# Altium project Cell430.PrjPcb (part 3 of 3)

## Sheet LTE_MCU_Rev01.SchDoc
size Letter; SheetNumber: 6; SheetTotal: 6
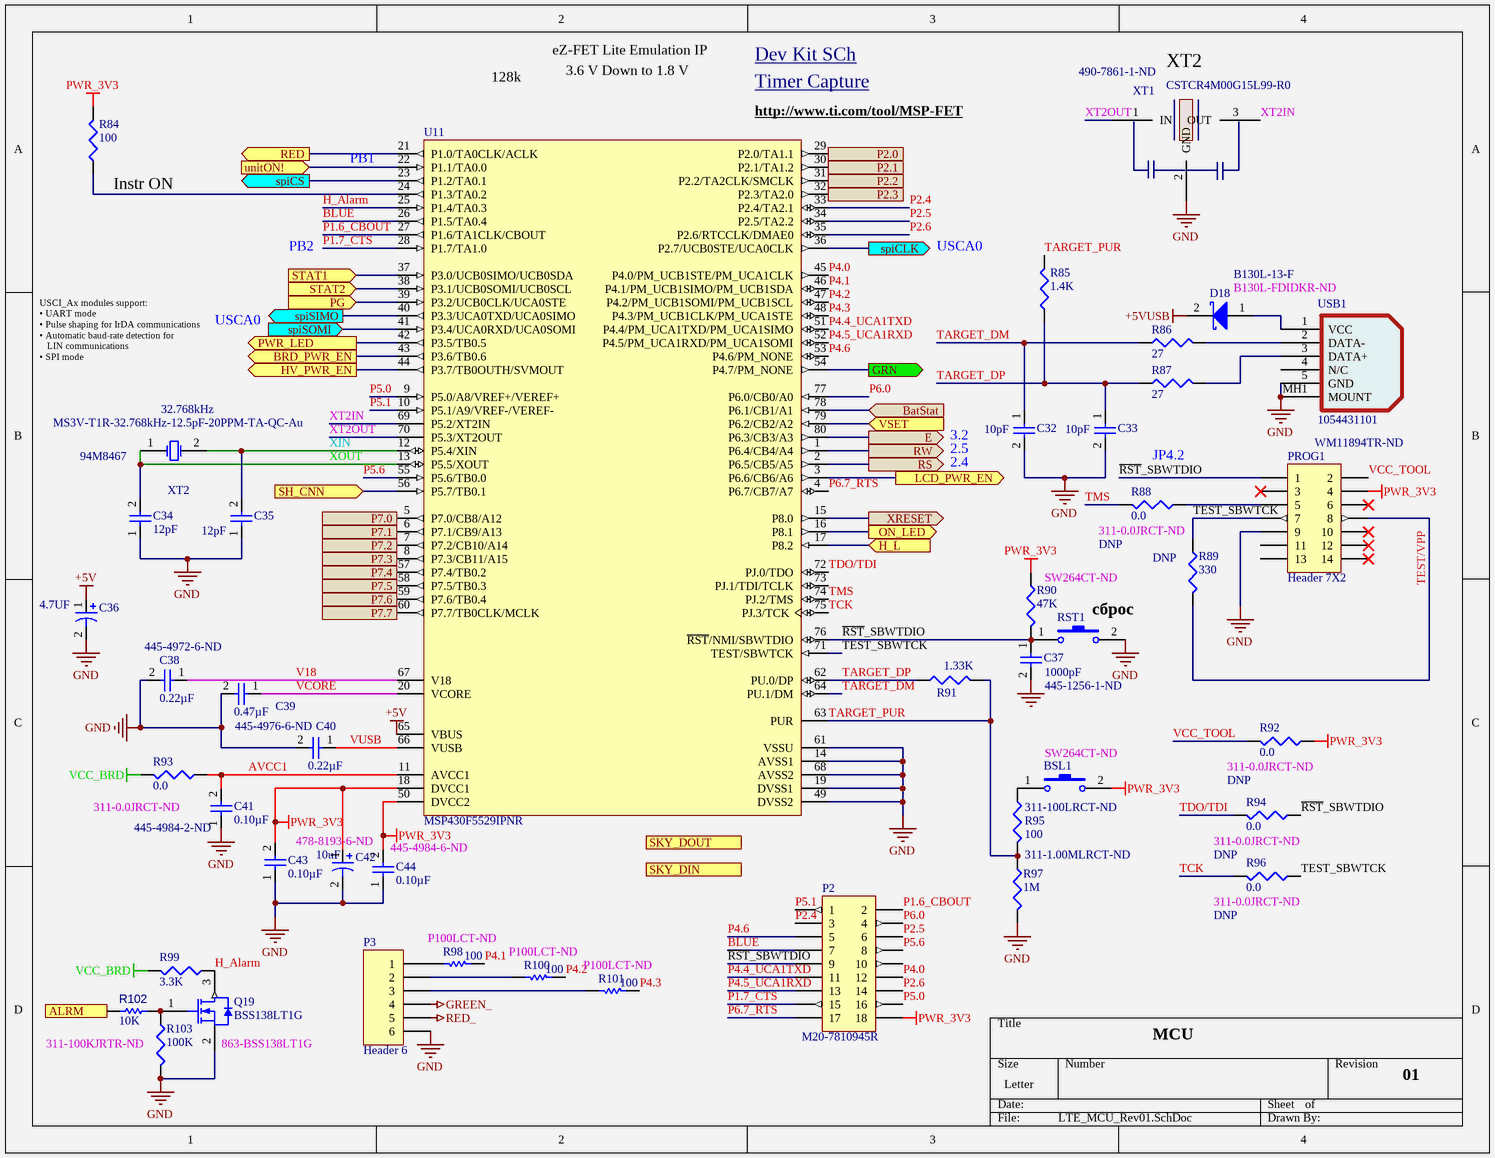
[diagram p5: LTE_MCU_Rev01.SchDoc]

### Parts
(Parts that share a designator on the sheet are numbered #1, #2 ... from top to bottom, then left to right.)
BSL1  Supplier Part Number 1: SW264CT-ND  [DTST-61K-Q_Rev01]  (hidden comment: B3F-6022)
C32  value 10pF  [SMD CAP 1005]  (hidden comment: C1005C0G1H100D050BA)
C33  value 10pF  [SMD CAP 1005]  (hidden comment: C1005C0G1H100D050BA)
C34  value 12pF  [SMD CAP 1005]  (hidden comment: C1005C0G1H120J050BA)
C35  value 12pF  [SMD CAP 1005]  (hidden comment: C1005C0G1H120J050BA)
C36  value 4.7UF  [TC3216-1206]  (hidden comment: T491A475K010AT)
C37  value 1000pF  Supplier Part Number 2: 445-1256-1-ND  [SMD CAP 1005]  (hidden comment: C1005X7R1H102K050BA)
C38  value 0.22µF  Supplier Part Number 2: 445-4972-6-ND  [SMD CAP 1005]  (hidden comment: C1005X5R1C224K050BB)
C39  value 0.47µF  Supplier Part Number 2: 445-4976-6-ND  [SMD CAP 1005]  (hidden comment: C1005X5R1C474K050BC)
C40  value 0.22µF  [SMD CAP 1005]  (hidden comment: C1005X5R1C224K050BB)
C41  value 0.10µF  Supplier Part Number 2: 445-4984-2-ND  [SMD CAP 1005]  (hidden comment: C1005X5R1A104M050BA)
C42  value 10uF  Supplier Part Number 2: 478-8193-6-ND  [TC3216-1206]  (hidden comment: F931A106MAA)
C43  value 0.10µF  [SMD CAP 1005]  (hidden comment: C1005X5R1A104M050BA)
C44  value 0.10µF  Supplier Part Number 2: 445-4984-6-ND  [SMD CAP 1005]  (hidden comment: C1005X5R1A104M050BA)
D18  B130L-13-F  Supplier Part Number 1: B130L-FDIDKR-ND  [SMA]
P2#2  M20-7810945R  [M20-7810945R]
P3  Header 6  [HDR1X6]
PROG1  Header 7X2  [HDR2X7]
Q19  BSS138LT1G  Supplier Part Number 1: 863-BSS138LT1G  [ONSC-SOT-23-3-318-08_V]
R84  value 100  [SMD RES 1005]  (hidden comment: RC0402FR-07100RL)
R85  value 1.4K  [SMD RES 1005]  (hidden comment: RC0402FR-071K47L)
R86  value 27  [SMD RES 1005]  (hidden comment: RC0402JR-0727RL)
R87  value 27  [SMD RES 1005]  (hidden comment: RC0402JR-0727RL)
R88  value 0.0  Supplier Part Number 1: 311-0.0JRCT-ND  Note: DNP  [SMD RES 1005]  (hidden comment: RC0402JR-070RL)
R89  value 330  Note: DNP  [SMD RES 1005]
R90  value 47K  [SMD RES 1005]  (hidden comment: RC0402FR-0747KL)
R91  value 1.33K  [SMD RES 1005]  (hidden comment: RC0402FR-071K33L)
R92  value 0.0  Supplier Part Number 1: 311-0.0JRCT-ND  Note: DNP  [SMD RES 1005]  (hidden comment: RC0402JR-070RL)
R93  value 0.0  Supplier Part Number 1: 311-0.0JRCT-ND  [SMD RES 1005]  (hidden comment: RC0402JR-070RL)
R94  value 0.0  Supplier Part Number 1: 311-0.0JRCT-ND  Note: DNP  [SMD RES 1005]  (hidden comment: RC0402JR-070RL)
R95  value 100  Supplier Part Number 2: 311-100LRCT-ND  [SMD RES 1005]  (hidden comment: RC0402FR-07100RL)
R96  value 0.0  Supplier Part Number 1: 311-0.0JRCT-ND  Note: DNP  [SMD RES 1005]  (hidden comment: RC0402JR-070RL)
R97  value 1M  Supplier Part Number 2: 311-1.00MLRCT-ND  [SMD RES 1005]  (hidden comment: RC0402FR-071ML)
R98  value 100  Supplier Part Number 1: P100LCT-ND  [SMD RES 1005]  (hidden comment: ERJ-2RKF1000X)
R99  value 3.3K  [SMD RES 1005]
R100  value 100  Supplier Part Number 1: P100LCT-ND  [SMD RES 1005]  (hidden comment: ERJ-2RKF1000X)
R101  value 100  Supplier Part Number 1: P100LCT-ND  [SMD RES 1005]  (hidden comment: ERJ-2RKF1000X)
R102  value 10K  [SMD RES 1005]  (hidden comment: RC0402JR-0710KL)
R103  value 100K  Supplier Part Number 1: 311-100KJRTR-ND  [SMD RES 1005]  (hidden comment: RC0402JR-07100KL)
RST1  Supplier Part Number 1: SW264CT-ND  [DTST-61K-Q_Rev01]  (hidden comment: B3F-6022)
U11  MSP430F5529IPNR  [PN0080A_L]
USB1  1054431101  Supplier Part Number 1: WM11894TR-ND  [1054431101]
XT1  CSTCR4M00G15L99-R0  Supplier Part Number 1: 490-7861-1-ND  [CSTCR4M00G15L99-R0]
XT2  value 32.768kHz  Supplier Part Number 1: 94M8467  [MS3V-T1R]  (hidden comment: MS3V-T1R-32.768kHz-12.5pF-20PPM-TA-QC-Au)

### Ports
ALRM (in, see LTE_block_diagram[2C]), BatStat (in, see LTE_block_diagram[2C]), BRD_PWR_EN (out, see LTE_block_diagram[2C]), E (out, see LTE_block_diagram[2C]), GRN (out, see LTE_block_diagram[2C]), H_L (in, see LTE_block_diagram[2C]), HV_PWR_EN (out, see LTE_block_diagram[2D]), LCD_PWR_EN (out, see LTE_block_diagram[2D]), ON_LED (out, see LTE_block_diagram[2D]), P2.0 (out, see LTE_block_diagram[2C]), P2.1 (out, see LTE_block_diagram[2D]), P2.2 (out, see LTE_block_diagram[2D]), P2.3 (out, see LTE_block_diagram[2D]), P7.0 (out, see LTE_block_diagram[2C]), P7.1 (out, see LTE_block_diagram[2C]), P7.2 (out, see LTE_block_diagram[2C]), P7.3 (out, see LTE_block_diagram[2C]), P7.4 (out, see LTE_block_diagram[2C]), P7.5 (out, see LTE_block_diagram[2C]), P7.6 (out, see LTE_block_diagram[2C]), P7.7 (out, see LTE_block_diagram[2C]), PG (in, see LTE_block_diagram[2C]), PWR_LED (out, see LTE_block_diagram[2D]), RED (out, see LTE_block_diagram[2C]), RS (out, see LTE_block_diagram[2C]), RW (out, see LTE_block_diagram[2C]), SH_CNN (in, see LTE_block_diagram[2C]), SKY_DIN (in), SKY_DOUT (out), spiCLK (out, see LTE_block_diagram[2C]), spiCS (out, see LTE_block_diagram[2C]), spiSIMO (out, see LTE_block_diagram[2C]), spiSOMI (in, see LTE_block_diagram[2C]), STAT1 (in, see LTE_block_diagram[2C]), STAT2 (in, see LTE_block_diagram[2C]), unitON! (in, see LTE_block_diagram[2C]), VSET (in, see LTE_block_diagram[2C]), XRESET (out, see LTE_block_diagram[2C])

### Nets
+5V: C36.1 U11.65(VBUS)
+5VUSB: D18.2(K)
GND: C32.2 C33.2 C34.1 C35.1 C36.2 C37.2 C38.2 C39.2 C40.2 C41.1 C42.2 C43.1 C44.1 P3.6 PROG1.9 Q19.2(S) R97.2 R103.2 RST1.2 U11.14(AVSS1) U11.19(DVSS1) U11.49(DVSS2) U11.61(VSSU) U11.68(AVSS2) USB1.5(GND) USB1.MH1(MOUNT) XT1.2(GND)
GREEN_: P3.4
PWR_3V3: BSL1.2 C42.1 C43.2 C44.2 P2#2.18 PROG1.4 R84.2 R90.1 R92.1 U11.18(DVCC1) U11.50(DVCC2)
RED_: P3.5
VCC_BRD: R93.2 R99.2
AVCC1: C41.2 R93.1 U11.11(AVCC1)
BLUE: P2#2.7 U11.26(P1.5/TA0.4)
H_Alarm: Q19.3(D) R99.1 U11.25(P1.4/TA0.3)
P1.6_CBOUT: P2#2.2 U11.27(P1.6/TA1CLK/CBOUT)
P1.7_CTS: P2#2.15 U11.28(P1.7/TA1.0)
P2.4: P2#2.3 U11.33(P2.4/TA2.1)
P2.5: P2#2.6 U11.34(P2.5/TA2.2)
P2.6: P2#2.14 U11.35(P2.6/RTCCLK/DMAE0)
P4.0: P2#2.12 U11.45(P4.0/PM_UCB1STE/PM_UCA1CLK)
P4.1: R98.1 U11.46(P4.1/PM_UCB1SIMO/PM_UCB1SDA)
P4.2: R100.1 U11.47(P4.2/PM_UCB1SOMI/PM_UCB1SCL)
P4.3: R101.1 U11.48(P4.3/PM_UCB1CLK/PM_UCA1STE)
P4.4_UCA1TXD: P2#2.11 U11.51(P4.4/PM_UCA1TXD/PM_UCA1SIMO)
P4.5_UCA1RXD: P2#2.13 U11.52(P4.5/PM_UCA1RXD/PM_UCA1SOMI)
P4.6: P2#2.5 U11.53(P4.6/PM_NONE)
P5.0: P2#2.16 U11.9(P5.0/A8/VREF+/VEREF+)
P5.1: P2#2.1 U11.10(P5.1/A9/VREF-/VEREF-)
P5.6: P2#2.8 U11.55(P5.6/TB0.0)
P6.0: P2#2.4 U11.77(P6.0/CB0/A0)
P6.7_RTS: P2#2.17 U11.4(P6.7/CB7/A7)
~{RST}_SBWTDIO: C37.1 P2#2.9 PROG1.1 R90.2 R94.1 RST1.1 U11.76(~{RST}/NMI/SBWTDIO)
TARGET_DM: C32.1 R86.1 U11.64(PU.1/DM)
TARGET_DP: C33.1 R85.1 R87.1 R91.1 U11.62(PU.0/DP)
TARGET_PUR: R85.2 R91.2 R95.2 R97.1 U11.63(PUR)
TCK: R96.2 U11.75(PJ.3/TCK)
TDO/TDI: R94.2 U11.72(PJ.0/TDO)
TEST_SBWTCK: PROG1.7 R89.1 R96.1 U11.71(TEST/SBWTCK)
TMS: R88.2 U11.74(PJ.2/TMS)
V18: C38.1 U11.67(V18)
VCC_TOOL: PROG1.2 R92.2
VCORE: C39.1 U11.20(VCORE)
VUSB: C40.1 U11.66(VUSB)
XIN: C35.2 U11.12(P5.4/XIN) XT2.2(OSC2)
XOUT: C34.2 U11.13(P5.5/XOUT) XT2.1(OSC1)
XT2IN: U11.69(P5.2/XT2IN) XT1.3(OUT)
XT2OUT: U11.70(P5.3/XT2OUT) XT1.1(IN)
NetBSL1_1: BSL1.1 R95.1
NetD18_1: D18.1(A) USB1.1(VCC)
NetP3_1: P3.1 R98.2
NetP3_2: P3.2 R100.2
NetP3_3: P3.3 R101.2
NetPROG1_5: PROG1.5 R88.1
NetPROG1_8: PROG1.8 R89.2
NetQ19_1: Q19.1(G) R102.1 R103.1
NetR84_1: R84.1 U11.24(P1.3/TA0.2)
NetR86_2: R86.2 USB1.2(DATA-)
NetR87_2: R87.2 USB1.3(DATA+)
NetR102_2: R102.2 ; port ALRM
NetU11_1: U11.1(P6.4/CB4/A4) ; port RW
NetU11_2: U11.2(P6.5/CB5/A5) ; port RS
NetU11_3: U11.3(P6.6/CB6/A6) ; port LCD_PWR_EN
NetU11_5: U11.5(P7.0/CB8/A12) ; port P7.0
NetU11_6: U11.6(P7.1/CB9/A13) ; port P7.1
NetU11_7: U11.7(P7.2/CB10/A14) ; port P7.2
NetU11_8: U11.8(P7.3/CB11/A15) ; port P7.3
NetU11_15: U11.15(P8.0) ; port XRESET
NetU11_16: U11.16(P8.1) ; port ON_LED
NetU11_17: U11.17(P8.2) ; port H_L
NetU11_21: U11.21(P1.0/TA0CLK/ACLK) ; port RED
NetU11_22: U11.22(P1.1/TA0.0) ; port unitON!
NetU11_23: U11.23(P1.2/TA0.1) ; port spiCS
NetU11_29: U11.29(P2.0/TA1.1) ; port P2.0
NetU11_30: U11.30(P2.1/TA1.2) ; port P2.1
NetU11_31: U11.31(P2.2/TA2CLK/SMCLK) ; port P2.2
NetU11_32: U11.32(P2.3/TA2.0) ; port P2.3
NetU11_36: U11.36(P2.7/UCB0STE/UCA0CLK) ; port spiCLK
NetU11_37: U11.37(P3.0/UCB0SIMO/UCB0SDA) ; port STAT1
NetU11_38: U11.38(P3.1/UCB0SOMI/UCB0SCL) ; port STAT2
NetU11_39: U11.39(P3.2/UCB0CLK/UCA0STE) ; port PG
NetU11_40: U11.40(P3.3/UCA0TXD/UCA0SIMO) ; port spiSIMO
NetU11_41: U11.41(P3.4/UCA0RXD/UCA0SOMI) ; port spiSOMI
NetU11_42: U11.42(P3.5/TB0.5) ; port PWR_LED
NetU11_43: U11.43(P3.6/TB0.6) ; port BRD_PWR_EN
NetU11_44: U11.44(P3.7/TB0OUTH/SVMOUT) ; port HV_PWR_EN
NetU11_54: U11.54(P4.7/PM_NONE) ; port GRN
NetU11_56: U11.56(P5.7/TB0.1) ; port SH_CNN
NetU11_57: U11.57(P7.4/TB0.2) ; port P7.4
NetU11_58: U11.58(P7.5/TB0.3) ; port P7.5
NetU11_59: U11.59(P7.6/TB0.4) ; port P7.6
NetU11_60: U11.60(P7.7/TB0CLK/MCLK) ; port P7.7
NetU11_78: U11.78(P6.1/CB1/A1) ; port BatStat
NetU11_79: U11.79(P6.2/CB2/A2) ; port VSET
NetU11_80: U11.80(P6.3/CB3/A3) ; port E

Not connected (* = marked no-connect by the designer): P2#2 10; PROG1 3* 6* 10* 11 12* 13 14*; U11 73(PJ.1/TDI/TCLK); USB1 4(N/C)

### Notes on the sheet
- 128k
- eZ-FET Lite Emulation IP
- 3.6 V Down to 1.8 V
- Timer Capture <http://processors.wiki.ti.com/index.php/MSP430_Timer_Compare>
- Dev Kit SCh <C:\Users\rchak\Documents\Projects\USB Node\Dev Board Hardware Design Files\MSP-EXP430F5529LP_Hardware_Design_Files\Hardware>
- (near XT1) XT2
- (near U11) PB1
- (near U11) http://www.ti.com/tool/MSP-FET
- (near R84) Instr ON
- PB2
- USCA0
- USCI_Ax modules support:
  • UART mode
  • Pulse shaping for IrDA communications
  • Automatic baud-rate detection for
  LIN communications
  • SPI mode
- (near C32) 2.5
- (near C32) 3.2
- 2.4
- JP4.2
- (near RST1) сброс
- TEST/VPP
- MCU
- 01

### Library data of the parts
BSL1 RST1 = SW-PB: SWITCH TACTILE SPST-NO 0.05A 24V; Manufacturer: Omron Electronics Inc-EMC Div; Published: 24-Mar-1999; LatestRevisionDate: 17-Jul-2002; LatestRevisionNote: Re-released for DXP Platform.; PackageReference: SPST-2; Publisher: Altium Limited; PackageDescription: Switch; 2 Leads; Cost: 0.36304; Digi-Key Part Number: SW264CT-ND; Manufacturer Part Number: B3F-6022; Supplier 1: Digi-Key
C32 C33 = Cap Semi: 10pF ±0.5pF 50V C0G, NP0 Ceramic Capacitor -55°C ~ 125°C Surface Mount, MLCC 0402 (1005 Metric) 0.039" L x 0.020" W (1.00mm x 0.50mm); Manufacturer: TDK Corporation; PackageReference: 0402; PackageDescription: Chip Capacitor; Digi-Key Part Number: 445-1235-1-ND; Manufacturer Part Number: C1005C0G1H100D050BA; Footprint: 0402 (1005 Metric); Cost: 0.02558; Supplier 1: Digi-Key; Note: *
C34 C35 = Cap Semi: CAP CER 12PF 50V C0G 0402; Manufacturer: TDK Corporation; PackageReference: 0402; PackageDescription: Chip Capacitor; Digi-Key Part Number: 445-1236-1-ND; Manufacturer Part Number: C1005C0G1H120J050BA; Footprint: 0402 (1005 Metric); Cost: 0.02558; Supplier 1: Digi-Key; Note: *
C36 = Cap Pol1: CAP TANT 4.7UF 10V 10% 1206; Manufacturer: Kemet; Published: 8-Jun-2000; LatestRevisionDate: 17-Jul-2002; LatestRevisionNote: Re-released for DXP Platform.; PackageReference: RB7.6-15; Publisher: Altium Limited; PackageDescription: Polarized Capacitor (Radial); 2 Leads; Footprint: 1206 (3216 Metric); Digi-Key Part Number: 399-3696-1-ND; Manufacturer Part Number: T491A475K010AT; Cost: 0.09660; Supplier 1: Mouser
C37 = Cap Semi: 1000pF ±10% 50V X7R Ceramic Capacitor -55°C ~ 125°C Surface Mount, MLCC 0402 (1005 Metric) 0.039" L x 0.020" W (1.00mm x 0.50mm); Manufacturer: TDK Corporation; PackageReference: 0402; PackageDescription: Chip Capacitor; Digi-Key Part Number: 445-1256-1-ND; Manufacturer Part Number: C1005X7R1H102K050BA; Footprint: 0402 (1005 Metric); Cost: 0.02558; Supplier 1: Digi-Key; Note: *; Supplier 2: Digi-Key
C38 C40 = Cap Semi: 0.22µF ±10% 16V X5R Ceramic Capacitor -55°C ~ 85°C Surface Mount, MLCC 0402 (1005 Metric) 0.039" L x 0.020" W (1.00mm x 0.50mm); Manufacturer: TDK Corporation; PackageReference: 0402; PackageDescription: Chip Capacitor; Digi-Key Part Number: 445-4972-1-ND; Manufacturer Part Number: C1005X5R1C224K050BB; Footprint: 0402 (1005 Metric); Cost: 0.02558; Supplier 1: Digi-Key; Note: *
  C38: Supplier 2: Digi-Key
C39 C41 C43 C44 = Cap Semi: 0.10µF ±20% 10V X5R Ceramic Capacitor -55°C ~ 85°C Surface Mount, MLCC 0402 (1005 Metric) 0.039" L x 0.020" W (1.00mm x 0.50mm); Manufacturer: TDK Corporation; PackageReference: 0402; PackageDescription: Chip Capacitor; Footprint: 0402 (1005 Metric); Supplier 1: Digi-Key; Note: *
  C39: Digi-Key Part Number: 445-4976-1-ND; Manufacturer Part Number: C1005X5R1C474K050BC; Supplier 2: Digi-Key
  C41 C44: Digi-Key Part Number: 445-4984-1-ND; Manufacturer Part Number: C1005X5R1A104M050BA; Cost: 0.02558; Supplier 2: Digi-Key
  C43: Digi-Key Part Number: 445-4984-1-ND; Manufacturer Part Number: C1005X5R1A104M050BA; Cost: 0.02558
C42 = Cap Pol1: CAP TANT 10UF 10V 20% 1206; Manufacturer: AVX Corporation; Published: 8-Jun-2000; LatestRevisionDate: 17-Jul-2002; LatestRevisionNote: Re-released for DXP Platform.; PackageReference: RB7.6-15; Publisher: Altium Limited; PackageDescription: Polarized Capacitor (Radial); 2 Leads; Footprint: 1206 (3216 Metric); Digi-Key Part Number: 478-8193-1-ND; Manufacturer Part Number: F931A106MAA; Cost: 0.09660; Supplier 1: Mouser; Supplier 2: Digi-Key
D18 = D Schottky: DIODE SCHOTTKY 30V 1A SMA; Manufacturer: Diodes Incorporated; Published: 8-Jun-2000; LatestRevisionDate: 17-Jul-2002; LatestRevisionNote: Re-released for DXP Platform.; PackageReference: SMB; Publisher: Altium Limited; PackageDescription: DO-214-AA/SMB; 2 C-Bend Leads; Body 5.3 x 3.6 mm, inc. leads (LxW); Code_JEDEC: DO-214-AA; Digi-Key Part Number: B130L-FDICT-ND; Manufacturer Part Number: B130L-13-F; ComponentLink1URL: http://www.diodes.com/datasheets/ds30151.pdf; ComponentLink1Description: Datasheet; ComponentLink2URL: C:\Users\rchak\Documents\Projects\CC3200 Development\Docs\Datasheets\Diodes; ComponentLink2Description: Folder; Cost: 0.12154; Supplier 1: Digi-Key
P2#2 = Header 9X2: CONN RCPT 2.54" SMD DUAL 18POS; Manufacturer: Harwin Inc.; LatestRevisionDate: 17-Jul-2002; LatestRevisionNote: Re-released for DXP Platform.; Publisher: Altium Limited; Digi-Key Part Number: 952-3226-2-ND; Manufacturer Part Number: M20-7810945R
P3 = Header 6: Header, 6-Pin; LatestRevisionDate: 17-Jul-2002; LatestRevisionNote: Re-released for DXP Platform.; Publisher: Altium Limited
PROG1 = Header 7X2: BERGSTIK II .100" DR STRAIGHT; Manufacturer: Amphenol FCI; Manufacturer Part Number: 67996-114HLF; LatestRevisionDate: 17-Jul-2002; LatestRevisionNote: Re-released for DXP Platform.; Publisher: Altium Limited; Digi-Key Part Number: 609-3491-ND
Q19 = CMP-1058-00767-1: MOSFET N-CH 50V 200MA SOT-23; Manufacturer: On Semiconductor; PD Max (W): 0.225; Coss Typ (pF): 12; V(BR)DSS Min (V): 50; VGS Max (V): 20; Channel Polarity: N Channel; Configuration: Single; Packing: Tape and Reel; VGS(th) Max (V): 1.5; Ciss Typ (pF): 40; Crss Typ (pF): 3.5; ID Max (A): 0.2; ComponentLink3Description: Package Specification; PackageDescription: 3-Pin Small Outline Transistor, Body 2.92 x 1.3 mm, Pitch 0.95 mm; PackageReference: SOT-23-3-318-08; RoHS: Pb-Free; Mounting Technology: Surface Mount; ComponentLink1Description: Manufacturer URL; ComponentLink2URL: http://www.onsemi.com/pub_link/Collateral/BSS138LT1-D.PDF; ComponentLink2Description: Datasheet; PackageVersion: Rev. AP, 11/2009; PartNumber: BSS138LT1G; Package Type: SOT-23-3; ComponentLink1URL: http://www.onsemi.com/; DatasheetVersion: Rev. 8; ComponentLink3URL: http://www.onsemi.cn/pub_link/Collateral/318-08.PDF; Digi-Key Part Number: BSS138LT1GOSCT-ND; Cost: 0.04997; Supplier 1: Mouser
R84 R95 = Res3: RES SMD 100 OHM 1% 1/16W 0402; Manufacturer: Yageo; Published: 8-Jun-2000; LatestRevisionDate: 29-May-2009; LatestRevisionNote: IPC-7351 Footprint Added.; PackageReference: J1-0603; Publisher: Altium Limited; PackageDescription: Chip Resistor; Digi-Key Part Number: 311-100LRCT-ND; Manufacturer Part Number: RC0402FR-07100RL; Cost: 0.00384; Supplier 1: Digi-Key; Supplier 2: Digi-Key
  R84: Supplier Part Number 2: 311-100LRCT-ND
R85 = Res3: RES SMD 1.47K OHM 1% 1/16W 0402; Manufacturer: Yageo; Published: 8-Jun-2000; LatestRevisionDate: 29-May-2009; LatestRevisionNote: IPC-7351 Footprint Added.; PackageReference: J1-0603; Publisher: Altium Limited; PackageDescription: Chip Resistor; Digi-Key Part Number: YAG3038CT-ND; Manufacturer Part Number: RC0402FR-071K47L; Cost: 0.00384; Supplier 1: Digi-Key
R86 R87 = Res3: RES SMD 27 OHM 5% 1/16W 0402; Manufacturer: Yageo; Published: 8-Jun-2000; LatestRevisionDate: 29-May-2009; LatestRevisionNote: IPC-7351 Footprint Added.; PackageReference: J1-0603; Publisher: Altium Limited; PackageDescription: Chip Resistor; Digi-Key Part Number: 311-27JRCT-ND; Manufacturer Part Number: RC0402JR-0727RL; Cost: 0.00384; Supplier 1: Digi-Key
R88 R92-R94 R96 = Res3: RES SMD 0.0 OHM JUMPER 1/16W; Manufacturer: Yageo; Published: 8-Jun-2000; LatestRevisionDate: 29-May-2009; LatestRevisionNote: IPC-7351 Footprint Added.; PackageReference: J1-0603; Publisher: Altium Limited; PackageDescription: Chip Resistor; Digi-Key Part Number: 311-0.0JRCT-ND; Manufacturer Part Number: RC0402JR-070RL; Cost: 0.00384; Supplier 1: Digi-Key
R89 = Res3: Published: 8-Jun-2000; LatestRevisionDate: 29-May-2009; LatestRevisionNote: IPC-7351 Footprint Added.; PackageReference: J1-0603; Publisher: Altium Limited; PackageDescription: Chip Resistor; Cost: 0.00384; Supplier 1: Digi-Key
R90 = Res3: RES SMD 47K OHM 1% 1/16W 0402; Manufacturer: Yageo; Published: 8-Jun-2000; LatestRevisionDate: 29-May-2009; LatestRevisionNote: IPC-7351 Footprint Added.; PackageReference: J1-0603; Publisher: Altium Limited; PackageDescription: Chip Resistor; Digi-Key Part Number: 311-47.0KLRCT-ND; Manufacturer Part Number: RC0402FR-0747KL; Cost: 0.00384; Supplier 1: Digi-Key
R91 = Res3: RES SMD 1.33K OHM 1% 1/16W 0402; Manufacturer: Yageo; Published: 8-Jun-2000; LatestRevisionDate: 29-May-2009; LatestRevisionNote: IPC-7351 Footprint Added.; PackageReference: J1-0603; Publisher: Altium Limited; PackageDescription: Chip Resistor; Digi-Key Part Number: 311-1.33KLRCT-ND; Manufacturer Part Number: RC0402FR-071K33L; Cost: 0.00384; Supplier 1: Digi-Key
R97 = Res3: RES SMD 1M OHM 1% 1/16W 0402; Manufacturer: Yageo; Published: 8-Jun-2000; LatestRevisionDate: 29-May-2009; LatestRevisionNote: IPC-7351 Footprint Added.; PackageReference: J1-0603; Publisher: Altium Limited; PackageDescription: Chip Resistor; Digi-Key Part Number: 311-1.00MLRCT-ND; Manufacturer Part Number: RC0402FR-071ML; Cost: 0.00384; Supplier 1: Digi-Key; Supplier 2: Digi-Key
R98 R100 R101 = Res1: RES SMD 100 OHM 1% 1/10W 0402; Manufacturer: Panasonic Electronic Components; Class I: Passive; Class II: Resistor; Loc: Vendor; Assembly Note: Install; Alternative: or equivalent; Protorype Price: 0.01500; Published: 8-Jun-2000; Revision: July-2002: Re-released for DXP Platform.; Publisher: Altium Limited; Digi-Key Part Number: P100LCT-ND; Manufacturer Part Number: ERJ-2RKF1000X; Type: SMD; footprint: 0603 (1608 metric); Price: 0.01050; Price for 100: 0.01050; Purchased by: Vendor; Cost: 0.00496; Supplier 1: Digi-Key
R99 = Res3: Manufacturer: Yageo; Published: 8-Jun-2000; LatestRevisionDate: 29-May-2009; LatestRevisionNote: IPC-7351 Footprint Added.; PackageReference: J1-0603; Publisher: Altium Limited; PackageDescription: Chip Resistor; Cost: 0.00384; Supplier 1: Digi-Key
R102 = Res1: RES SMD 10K OHM 5% 1/16W 0402; Manufacturer: Panasonic Electronic Components; Loc: Vendor; Assembly Note: Install; Published: 8-Jun-2000; LatestRevisionDate: 17-Jul-2002; LatestRevisionNote: Re-released for DXP Platform.; PackageReference: AXIAL-0.3; Publisher: Altium Limited; PackageDescription: Axial Device, Thru-Hole; 2 Leads; 0.3 in Pin Spacing; Price for 50: 0.04820; Manufacturer Part Number: RC0402JR-0710KL; Type: SMD; Cost: 0.00544; Digi-Key Part Number: 311-10KJRCT-ND; Footprint: 0402 (1005 Metric)
R103 = Res3: RES SMD 100K OHM 5% 1/16W 0402; Manufacturer: Yageo; Published: 8-Jun-2000; LatestRevisionDate: 29-May-2009; LatestRevisionNote: IPC-7351 Footprint Added.; PackageReference: J1-0603; Publisher: Altium Limited; PackageDescription: Chip Resistor; Digi-Key Part Number: 311-100KJRCT-ND; Manufacturer Part Number: RC0402JR-07100KL; Cost: 0.00172; Supplier 1: Digi-Key
U11 = CMP-0365-00413-2: IC MCU 16BIT 128KB FLASH 80LQFP; Manufacturer: Texas Instruments; Flash(KB): 128; ADC Channels: 16; Temp Sensor: Yes; SubFamily: 5 Series; Frequency(MHz): 25; Multiplier: 32x32; DMA: 3; USB: 1; SRAM(B): 8192; GPIO: 63; USCI_A (UART/LIN/IrDA/SPI): 2; Eco-Plan: Green (RoHS & no Sb/Br); ADC: 12-bit SAR; Timers - 16-bit: 4; ComponentLink2URL: C:\Users\Roman\Documents\Projects\GalaS-NDT\Galas-HV-Det_Rev-00\Docs\Datasheets\MSP430; DatasheetVersion: SLAS590I; ComponentLink2Description: Foder; ComponentLink3URL: http://www.ti.com/lit/ml/mtqf010a/mtqf010a.pdf; Watchdog: Yes; Brown Out Reset: Yes; PartNumber: MSP430F5529IPNR; Comparators: Yes; Code_JEDEC: MS-018; PackageReference: PN0080A; ComponentLink1Description: ADC12; SVS: Yes; USCI_B (I2C & SPI): 2; Mounting Technology: Surface Mount; Real-Time Clock: Yes; ComponentLink3Description: Package Specification; PackageDescription: 80-Pin Plastic Quad Flat Pack, Body 12 x 12 mm, Pitch 0.5 mm; ComponentLink1URL: C:\Users\Roman\Documents\Projects\GalaS-NDT\Galas-HV-Det_Rev-00\Docs\Datasheets\MSP430\ADC12_A.pdf; ComponentLink4URL: C:\Users\Roman\Documents\Projects\GalaS-NDT\Galas-HV-Det_Rev-00\Docs\Datasheets\MSP430\Digital IO Module.pdf; ComponentLink4Description: Digital IO Module; ComponentLink5URL: C:\Users\Roman\Documents\Projects\GalaS-NDT\Galas-HV-Det_Rev-00\Docs\Datasheets\MSP430\User Guide; ComponentLink5Description: Dev Kit; Digi-Key Part Number: 296-27306-1-ND; Manufacturer Part Number: MSP430F5529IPNR; ComponentLink6Description: DigiKey; ComponentLink6URL: https://www.digikey.com/en/products/detail/texas-instruments/MSP430F5529IPNR/2273792?s=N4IgTCBcDaILIGUAKAWAzABgGIFYdgE4BJJAOQCUQBdAXyA; ComponentLink7Description: Datasheet; ComponentLink7URL: https://www.ti.com/lit/ds/symlink/msp430f5529.pdf?HQS=dis-dk-null-digikeymode-dsf-pf-null-wwe&ts=1768768929655; ComponentLink8Description: Pin Diagrams; ComponentLink8URL: https://www.ti.com/lit/ds/symlink/msp430f5529.pdf?HQS=dis-dk-null-digikeymode-dsf-pf-null-wwe&ts=1768768929655#page=10
USB1 = 1054431101: USB - micro B Receptacle Connector 5 Position Surface Mount, Right Angle, Horizontal; Manufacturer: Molex, LLC; Manufacturer Part Number: 1054431101; Digi-Key Part Number: WM11894CT-ND; ComponentLink1Description: C Datasheet; ComponentLink1URL: *; Node: *; Supplier 1: Digi-Key
XT1 = CSTCR4M00G15L99-R0: CER RES 4.0000MHZ 39PF SMD; Manufacturer: Murata Electronics North America; Digi-Key Part Number: 490-7861-1-ND; Manufacturer Part Number: CSTCR4M00G15L99-R0; Note: *; Supplier 1: Digi-Key; ComponentLink1URL: C:\Users\Roman\Documents\Projects\GalaS-NDT\Galas-HV-Det_Rev-00\Docs\Datasheets\Oscillator\CSTCR4M00G15L99-R0.pdf; ComponentLink1Description: C Datasheet
XT2 = XTAL: Crystals 32.768 kHz 12.5 pF +/-20 PPM -40/+85C; Manufacturer: Microcrystal; Published: 8-Jun-2000; LatestRevisionDate: 17-Jul-2002; LatestRevisionNote: Re-released for DXP Platform.; PackageReference: R38; Publisher: Altium Limited; PackageDescription: Crystal, Thru-Hole; 2 Leads; Body 3.1 x 8.2 mm (Dia.xH); Manufacturer Part Number: MS3V-T1R-32.768kHz-12.5pF-20PPM-TA-QC-Au; Note: *; ComponentLink1Description: C Datasheet; ComponentLink1URL: C:\Users\Roman\Documents\Projects\GalaS-NDT\Galas-HV-Det_Rev-00\Docs\Datasheets\Oscillator\MS3V-T1R-1085741.pdf; Supplier 1: Newark; Mouser #:: 428-200001-ML02

## Nets that join several sheets
GND: LTE_adapter_Rev02 (36 pins), LTE_auto_start_Rev01 (5 pins), LTE_power_Rev01 (18 pins), LTE_UART_USB_adapter (13 pins), LTE_MCU_Rev01 (27 pins)
PWR_3V3: LTE_power_Rev01 (C?#1.1 U?#1.5), LTE_MCU_Rev01 (11 pins)
VBUS_USB1: LTE_power_Rev01 (D?#1.1), LTE_UART_USB_adapter (7 pins)
VCC_3V9: LTE_adapter_Rev02 (9 pins), LTE_auto_start_Rev01 (PWR.1 U2.1), LTE_power_Rev01 (6 pins)
VCC_SKY_VREF: LTE_adapter_Rev02 (R3.2 U1.2), LTE_UART_USB_adapter (C15.1 C18.2 U17.3 U17.9)
SKY_CTS: LTE_adapter_Rev02 (J2.9 P2#1.2), LTE_UART_USB_adapter (R16.2)
SKY_DIN: LTE_adapter_Rev02 (J1.3 P1.3 UART.2), LTE_UART_USB_adapter (U17.7)
SKY_DOUT: LTE_adapter_Rev02 (J1.2 P1.2 UART.1), LTE_UART_USB_adapter (U17.10)
Sky_ON_OFF_SW: LTE_adapter_Rev02 (C5.1 Q1.1 R1.2 R10.2), LTE_auto_start_Rev01 (P6.2)
SKY_RTS: LTE_adapter_Rev02 (J2.5 P2#1.6 R6.2), LTE_UART_USB_adapter (R15.2)